# EAGLE schematic adapter (EAGLE 8.2.1)
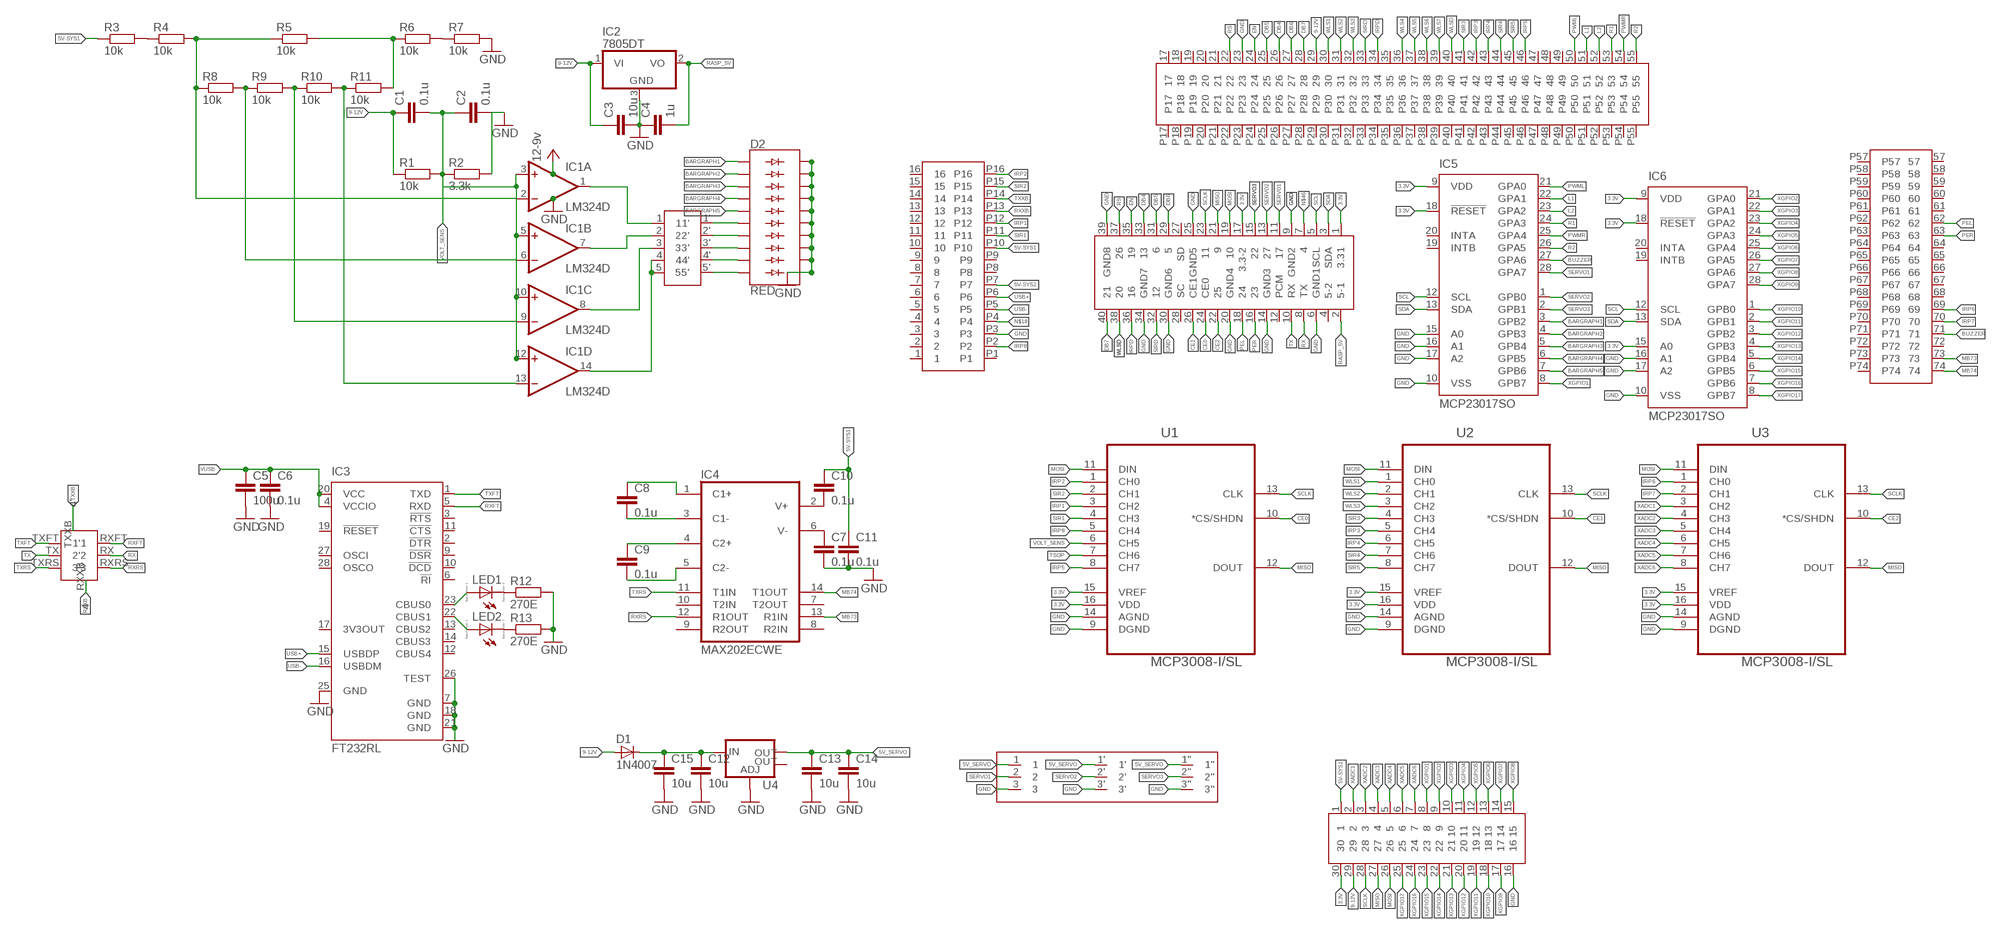
[diagram p0: schematic, sheet 1]

## Parts
C1  0.1u  C-EUC1206  [C1206]
C2  0.1u  C-EUC1206  [C1206]
C3  10u  C-EUC1206  [C1206]
C4  1u  C-EUC1206  [C1206]
C5  100u  C-EUC1206  [C1206]
C6  0.1u  C-EUC1206  [C1206]
C7  0.1u  C-EUC1206  [C1206]
C8  0.1u  C-EUC1206  [C1206]
C9  0.1u  C-EUC1206  [C1206]
C10  0.1u  C-EUC1206  [C1206]
C11  0.1u  C-EUC1206  [C1206]
C12  10u  C-EUC1206  [C1206]
C13  10u  C-EUC1206  [C1206]
C14  10u  C-EUC1206  [C1206]
C15  10u  C-EUC1206  [C1206]
D1  1N4007  [SMA]
D2  RED  LED_BARGRAPH_10RED  [LED_BARGRAPH_10]
IC1  LM324D  [SO14]
IC2  7805DT  [TO252]
IC3  FT232RL  [SSOP28]
IC4  MAX202ECWE  [SO16L]
IC5  MCP23017SO  [SO28W]
IC6  MCP23017SO  [SO28W]
LED1  LED_E  [LED_1206]
LED2  LED_E  [LED_1206]
R1  10k  R-EU_M1206  [M1206]
R2  3.3k  R-EU_M1206  [M1206]
R3  10k  R-EU_M1206  [M1206]
R4  10k  R-EU_M1206  [M1206]
R5  10k  R-EU_M1206  [M1206]
R6  10k  R-EU_M1206  [M1206]
R7  10k  R-EU_M1206  [M1206]
R8  10k  R-EU_M1206  [M1206]
R9  10k  R-EU_M1206  [M1206]
R10  10k  R-EU_M1206  [M1206]
R11  10k  R-EU_M1206  [M1206]
R12  270E  R-EU_R1206  [R1206]
R13  270E  R-EU_R1206  [R1206]
U1  MCP3008-I/SL  [SOIC127P600X175-16N]
U2  MCP3008-I/SL  [SOIC127P600X175-16N]
U3  MCP3008-I/SL  [SOIC127P600X175-16N]
U4  V_REG_LM1117SOT223  [SOT223]
U$1  BOARD  [FEMHEADER]
U$2  MALE_HEADER  [MALE_HEADER_PACKAGE]
U$3  SWITCH_RXTX  [SWITCH_RXTX]
U$4  SWITCH5  [SWITCH5]
U$5  PORT_EXP  [PORT_EXP]
U$7  SERVO  [SERVO]

## Nets
3.3V: IC5.9(VDD) IC5.18(!RESET) IC6.9(VDD) IC6.15(A0) IC6.18(!RESET) U1.15(VREF) U1.16(VDD) U2.15(VREF) U2.16(VDD) U3.15(VREF) U3.16(VDD) U$2.1(3.31) U$2.17(3.3-2) U$5.30
5V-SYS1: C10.1 C11.1 R3.1 U$1.P10 U$5.1
5V-SYS2: U$1.P7
5V_SERVO: C13.1 C14.1 U4.2(OUT) U$7.1 U$7.1" U$7.1'
9-12V: C1.1 C3.1 D1.A IC2.1(VI) R1.1 U$1.29 U$5.29
BARGRAPH1: D2.1(A) IC5.3(GPB2)
BARGRAPH2: D2.2(A1) IC5.4(GPB3)
BARGRAPH3: D2.3(A2) IC5.5(GPB4)
BARGRAPH4: D2.4(A3) IC5.6(GPB5)
BARGRAPH5: D2.5(A4) IC5.7(GPB6)
BUZZER: IC5.27(GPA6) U$1.71
CE0: U1.10(*CS/SHDN) U$2.24(CE0)
CE1: U2.10(*CS/SHDN) U$2.26(CE1)
CE2: U3.10(*CS/SHDN) U$2.22
DB4: U$1.26 U$2.33
DB5: U$1.25 U$2.31
DB6: U$1.27 U$2.29
DB7: U$1.28 U$2.40
EN: U$1.24 U$2.35
GND: C2.2 C3.2 C4.1 C5.2 C6.2 C7.2 C11.2 C12.2 C13.2 C14.2 C15.2 D2.11(C9) D2.12(C8) D2.13(C7) D2.14(C6) D2.15(C5) D2.16(C4) D2.17(C3) D2.18(C2) D2.19(C1) D2.20(C) IC2.3(GND) IC3.7(GND) IC3.18(GND) IC3.21(GND) IC3.25(GND) IC3.26(TEST) IC5.10(VSS) IC5.15(A0) IC5.16(A1) IC5.17(A2) IC6.10(VSS) IC6.16(A1) IC6.17(A2) R2.2 R7.2 R12.2 R13.2 U1.9(DGND) U1.14(AGND) U2.9(DGND) U2.14(AGND) U3.9(DGND) U3.14(AGND) U4.1(ADJ) U$1.23 U$1.P3 U$2.6(GND1) U$2.9(GND2) U$2.14(GND3) U$2.20(GND4) U$2.25(GND5) U$2.30(GND6) U$2.34(GND7) U$2.39(GND8) U$5.16 U$7.3 U$7.3" U$7.3'
IRP1: U1.3(CH2) U$1.P12
IRP2: U1.1(CH0) U$1.P16
IRP3: U2.5(CH4) U$1.42
IRP4: U2.6(CH5) U$1.43
IRP5: U1.8(CH7) U$1.46
IRP6: U3.1(CH0) U$1.69
IRP7: U3.2(CH1) U$1.70
IRP8: U1.5(CH4) U$1.P2
IRPD: U$1.34 U$2.36
L1: IC5.22(GPA1) U$1.51
L2: IC5.23(GPA2) U$1.52
MB73: IC4.13(R1IN) U$1.73
MB74: IC4.14(T1OUT) U$1.74
MISO: U1.12(DOUT) U2.12(DOUT) U3.12(DOUT) U$2.21 U$5.27
MOSI: U1.11(DIN) U2.11(DIN) U3.11(DIN) U$2.19 U$5.26
N$1: R3.2 R4.1
N$2: C12.1 C15.1 D1.K(C) U4.3(IN)
N$3: IC1.2(A:-IN) R4.2 R5.1 R8.1
N$4: R5.2 R6.1 R11.2
N$5: R6.2 R7.1
N$6: IC1.6(B:-IN) R8.2 R9.1
N$7: IC1.9(C:-IN) R9.2 R10.1
N$8: IC1.13(D:-IN) R10.2 R11.1
N$9: D2.6(A5) U$4.1'
N$10: D2.7(A6) U$4.2'
N$11: D2.8(A7) U$4.3'
N$12: D2.9(A8) U$4.4'
N$13: D2.10(A9) U$4.5'
N$14: IC1.14(D:OUT) U$4.4 U$4.5
N$15: IC1.8(C:OUT) U$4.3
N$16: IC1.7(B:OUT) U$4.2
N$17: IC1.1(A:OUT) U$4.1
N$18: U$1.P4
N$23: IC3.23(CBUS0) LED1.A
N$24: IC3.22(CBUS1) LED2.A
N$25: LED1.C R12.1
N$26: LED2.C R13.1
N$27: C10.2 IC4.2(V+)
N$28: C7.1 IC4.6(V-)
N$29: C8.1 IC4.1(C1+)
N$30: C8.2 IC4.3(C1-)
N$31: C9.1 IC4.4(C2+)
N$32: C9.2 IC4.5(C2-)
N$46: U$2.7
PEL: U$1.62 U$2.18
PER: U$1.63 U$2.16
PWML: IC5.21(GPA0) U$1.50
PWMR: IC5.25(GPA4) U$1.54
R1: IC5.24(GPA3) U$1.53
R2: IC5.26(GPA5) U$1.55
RASP_5V: C4.2 IC2.2(VO) U$2.2(5-1)
RS: U$1.22 U$2.37
RX: U$2.8(TX) U$3.RX
RXFT: IC3.5(RXD) U$3.RXFT
RXRS: IC4.12(R1OUT) U$3.RXRS
RXXB: U$1.P13 U$3.RXXB
SCL: IC5.12(SCL) IC6.12(SCL) U$2.5(SCL)
SCLK: U1.13(CLK) U2.13(CLK) U3.13(CLK) U$2.23 U$5.28
SDA: IC5.13(SDA) IC6.13(SDA) U$2.3(SDA)
SERVO1: IC5.28(GPA7) U$2.11 U$7.2
SERVO2: IC5.1(GPB0) U$2.13 U$7.2'
SERVO3: IC5.2(GPB1) U$2.15 U$7.2"
SIR1: U1.4(CH3) U$1.P11
SIR2: U1.2(CH1) U$1.P15
SIR3: U2.4(CH3) U$1.41
SIR4: U2.7(CH6) U$1.44
SIR5: U2.8(CH7) U$1.45
SIRD: U$1.33 U$2.32
TSOP: U1.7(CH6)
TX: U$2.10(RX) U$3.TX(2')
TXFT: IC3.1(TXD) U$3.TXFT(1')
TXRS: IC4.11(T1IN) U$3.TXRS(3')
TXXB: U$1.P14 U$3.TXXB(4')
USB+: IC3.15(USBDP) U$1.P6
USB-: IC3.16(USBDM) U$1.P5
VOLT_SENS: C1.2 C2.1 IC1.3(A:+IN) IC1.5(B:+IN) IC1.10(C:+IN) IC1.12(D:+IN) R1.2 R2.1 U1.6(CH5)
VUSB: C5.1 C6.1 IC3.4(VCCIO) IC3.20(VCC)
WLS1: U2.1(CH0) U$1.30
WLS2: U2.2(CH1) U$1.31
WLS3: U2.3(CH2) U$1.32
WLS4: U$1.36
WLS5: U$1.37
WLS6: U$1.38
WLS7: U$1.39
WLSD: U$1.40 U$2.38
XADC1: U3.3(CH2) U$5.2
XADC2: U3.4(CH3) U$5.3
XADC3: U3.5(CH4) U$5.4
XADC4: U3.6(CH5) U$5.5
XADC5: U3.7(CH6) U$5.6
XADC6: U3.8(CH7) U$5.7
XGPIO1: IC5.8(GPB7) U$5.8
XGPIO2: IC6.21(GPA0) U$5.9
XGPIO3: IC6.22(GPA1) U$5.10
XGPIO4: IC6.23(GPA2) U$5.11
XGPIO5: IC6.24(GPA3) U$5.12
XGPIO6: IC6.25(GPA4) U$5.13
XGPIO7: IC6.26(GPA5) U$5.14
XGPIO8: IC6.27(GPA6) U$5.15
XGPIO9: IC6.28(GPA7) U$5.17
XGPIO10: IC6.1(GPB0) U$5.18
XGPIO11: IC6.2(GPB1) U$5.19
XGPIO12: IC6.3(GPB2) U$5.20
XGPIO13: IC6.4(GPB3) U$5.21
XGPIO14: IC6.5(GPB4) U$5.22
XGPIO15: IC6.6(GPB5) U$5.23
XGPIO16: IC6.7(GPB6) U$5.24
XGPIO17: IC6.8(GPB7) U$5.25
Unconnected: IC3.2(!DTR) IC3.3(!RTS) IC3.6(!RI) IC3.9(!DSR) IC3.10(!DCD) IC3.11(!CTS) IC3.12(CBUS4) IC3.13(CBUS2) IC3.14(CBUS3) IC3.17(3V3OUT) IC3.19(!RESET) IC3.27(OSCI) IC3.28(OSCO) IC4.7(T2OUT) IC4.8(R2IN) IC4.9(R2OUT) IC4.10(T2IN) IC5.19(INTB) IC5.20(INTA) IC6.19(INTB) IC6.20(INTA) U4.4(OUT) U$1.1 U$1.2 U$1.3 U$1.4 U$1.5 U$1.6 U$1.7 U$1.8 U$1.9 U$1.10 U$1.11 U$1.12 U$1.13 U$1.14 U$1.15 U$1.16 U$1.17 U$1.18 U$1.19 U$1.20 U$1.21 U$1.35 U$1.47 U$1.48 U$1.49 U$1.57 U$1.58 U$1.59 U$1.60 U$1.61 U$1.64 U$1.65 U$1.66 U$1.67 U$1.68 U$1.72 U$1.P1 U$1.P8 U$1.P9 U$1.P17 U$1.P18 U$1.P19 U$1.P20 U$1.P21 U$1.P22 U$1.P23 U$1.P24 U$1.P25 U$1.P26 U$1.P27 U$1.P28 U$1.P29 U$1.P30 U$1.P31 U$1.P32 U$1.P33 U$1.P34 U$1.P35 U$1.P36 U$1.P37 U$1.P38 U$1.P39 U$1.P40 U$1.P41 U$1.P42 U$1.P43 U$1.P44 U$1.P45 U$1.P46 U$1.P47 U$1.P48 U$1.P49 U$1.P50 U$1.P51 U$1.P52 U$1.P53 U$1.P54 U$1.P55 U$1.P57 U$1.P58 U$1.P59 U$1.P60 U$1.P61 U$1.P62 U$1.P63 U$1.P64 U$1.P65 U$1.P66 U$1.P67 U$1.P68 U$1.P69 U$1.P70 U$1.P71 U$1.P72 U$1.P73 U$1.P74 U$2.4(5-2) U$2.12(PCM) U$2.27(SD) U$2.28(SC)

## Power pins joined to a net without a drawn wire
GND: IC4.15(GND)
V+: IC1.4(P:V+)
V-: IC1.11(P:V-)
VCC: IC4.16(VCC)

## Library data of the parts
C1-C15 = rcl:C-EU: CAPACITOR, European symbol
D1 = casovac:1N4007
D2 = SparkFun-LED:LED_BARGRAPH_10: Young Sun LED Tech - YSLB-10251G5-10 10-Segment LED Bar Graph Features: Red Vf = 2.1V, Ifmax = 20mA Yellow Vf = 2.1V, Ifmax = 20mA Blue Vf = 3.4V, Ifmax = 20mA Green Vf = 3.4V, Ifmax = 20mA SparkFun Products: Red <https://www.sparkfun.com/products/9935> Yellow <https://www.sparkfun.com/products/9936> Green <https://www.sparkfun.com/products/9938> Blue <https://www.sparkfun.com/products/9937>; PROD_ID: DIO-10615
IC1 = linear:LM324: OP AMP
IC2 = linear:78*: Positive VOLTAGE REGULATOR Source: http://cache.national.com/ds/LM/LM78L05.pdf http://www.fairchildsemi.com/ds/LM/LM7805.pdf
IC3 = ftdichip:FT232R: Source: http://www.ftdichip.com/Documents/DataSheets/DS_FT232R_v104.pdf; MPN: FT232RL; OC_FARNELL: 1146032; OC_NEWARK: 91K9918
IC4 = maxim:MAX202ECWE: RS232 TRANSCEIVER; MPN: MAX202ECWE+T; OC_FARNELL: 9724419; OC_NEWARK: 67K4364
IC5 IC6 = adafruit:MCP23017: http://ww1.microchip.com/downloads/en/DeviceDoc/21952a.pdf Source: http://ww1.microchip.com/downloads/en/DeviceDoc/21952a.pdf
LED1 LED2 = eagle-ltspice:LED_E: LED Source: http://www.osram.convergy.de Source: www.luxeon.com Source: www.kingbright.com; SPICEMODEL: NONE; SPICEPREFIX: D; SPICETYPE: diode
R1-R13 = resistor:R-EU_: RESISTOR, European symbol
U1-U3 = MCP3008-I_SL:MCP3008-I/SL: 10BIT ADC, 8 CH, SPI, SMD; AVAILABILITY: Good; DESCRIPTION: Eight Channel SPI Serial Interface 2.7 V 10-Bit A/D Converter SMT - SOIC-16; MF: Microchip; MP: MCP3008-I/SL; PACKAGE: SOIC-16 Microchip; PRICE: 2.02 USD
U4 = SparkFun-IC-Power:V_REG_LM1117: Voltage Regulator LM1117 Standard adjustable voltage regulator but in SMD form. Spark Fun Electronics SKU : COM-00595; PROD_ID: VREG-08170
U$1 = fem_header:BOARD
U$2 = male_header_device:MALE_HEADER
U$3 = switch:SWITCH_RXTX
U$4 = switch:SWITCH5
U$5 = fem_header:PORT_EXP
U$7 = switch:SERVO